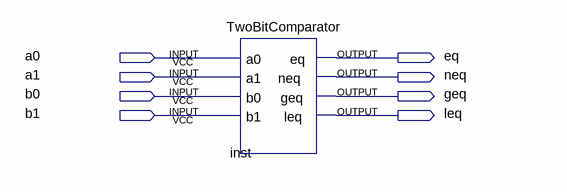
[diagram p0: schematic sheet]
// Quartus schematic TwoBitComparatorSymbol.bdf as structural Verilog: 1 symbols, 8 pins
module TwoBitComparatorSymbol (
  input  a0,
  input  a1,
  input  b0,
  input  b1,
  output eq,
  output neq,
  output geq,
  output leq
);

  TwoBitComparator inst (.a0(a0), .a1(a1), .b0(b0), .b1(b1), .eq(eq), .neq(neq), .geq(geq), .leq(leq));
endmodule
